# Altium schematic sheet ActuatorTop.SchDoc
size Letter
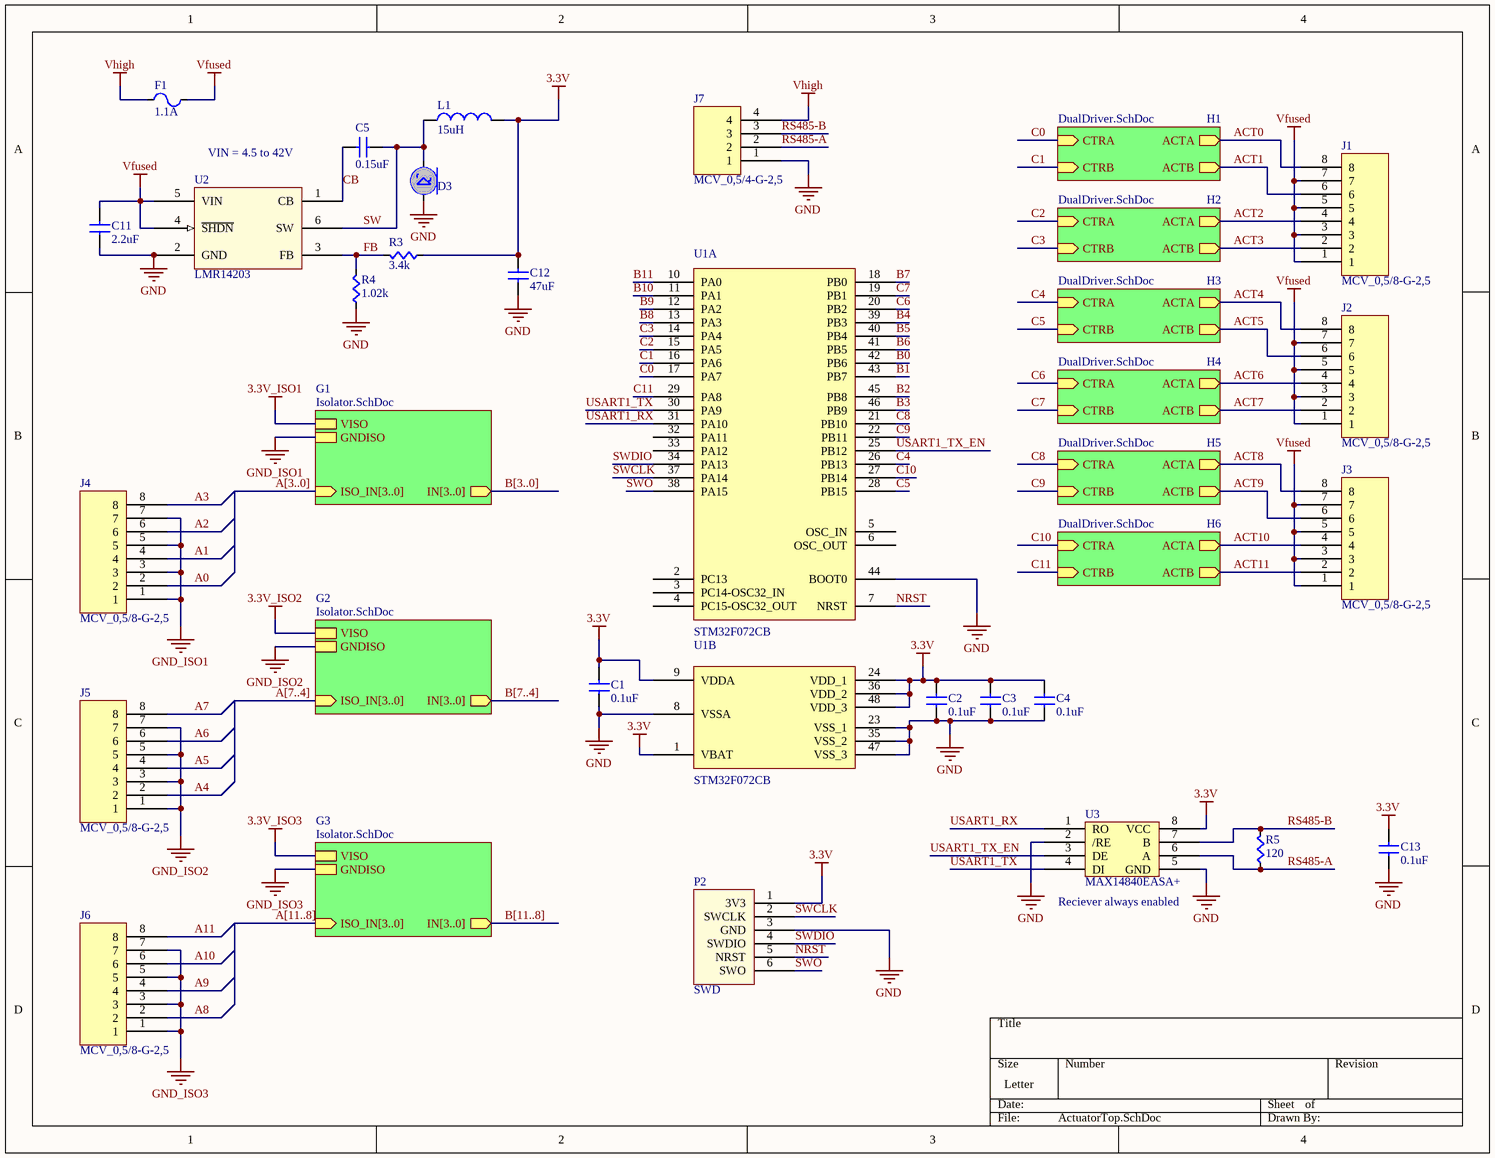
[diagram p0: ActuatorTop.SchDoc]

## Parts
C1  value 0.1uF  [CAPC0603]  (hidden comment: Cap)
C2  value 0.1uF  [CAPC0603]  (hidden comment: Cap)
C3  value 0.1uF  [CAPC0603]  (hidden comment: Cap)
C4  value 0.1uF  [CAPC0603]  (hidden comment: Cap)
C5  value 0.15uF  [CAPC0603]  (hidden comment: Cap)
C11  value 2.2uF  [CAPC0805]  (hidden comment: Cap)
C12  value 47uF  [CAPC1206]  (hidden comment: Cap)
C13  value 0.1uF  [CAPC0603]  (hidden comment: Cap)
D3  Schottky  [1N5819HW-7-F]  (value not drawn)
F1  value 1.1A  [PTC7451X11N]  (hidden comment: PTC Fuse)
J1  MCV_0,5/8-G-2,5  [MCV_0,5/8-G-2,5]
J2  MCV_0,5/8-G-2,5  [MCV_0,5/8-G-2,5]
J3  MCV_0,5/8-G-2,5  [MCV_0,5/8-G-2,5]
J4  MCV_0,5/8-G-2,5  [MCV_0,5/8-G-2,5]
J5  MCV_0,5/8-G-2,5  [MCV_0,5/8-G-2,5]
J6  MCV_0,5/8-G-2,5  [MCV_0,5/8-G-2,5]
J7  MCV_0,5/4-G-2,5  [MCV_0,5/4-G-2,5]
L1  Inductance: 15uH  [INDP6060X48N]  (hidden comment: Inductor)
P2  SWD  [SWD_STM32]
R3  value 3.4k  [RES0603]  (hidden comment: Res)
R4  value 1.02k  [RES0603]  (hidden comment: Res)
R5  value 120  [RES0603]  (hidden comment: Res)
U1  STM32F072CB  [STM32F072CB]  (parts A,B of 2)
U2  LMR14203  [SOT95P280X110-6N]
U3  MAX14840EASA+  [MAX14840EASA+]

## Sub-sheets
G1 = Isolator.SchDoc: GNDISO, VISO, ISO_IN[3..0] (in), IN[3..0] (out)
G2 = Isolator.SchDoc: GNDISO, VISO, ISO_IN[3..0] (in), IN[3..0] (out)
G3 = Isolator.SchDoc: GNDISO, VISO, ISO_IN[3..0] (in), IN[3..0] (out)
H1 = DualDriver.SchDoc: ACTA (out), CTRA (in), ACTB (out), CTRB (in)
H2 = DualDriver.SchDoc: ACTA (out), CTRA (in), ACTB (out), CTRB (in)
H3 = DualDriver.SchDoc: ACTA (out), CTRA (in), ACTB (out), CTRB (in)
H4 = DualDriver.SchDoc: ACTA (out), CTRA (in), ACTB (out), CTRB (in)
H5 = DualDriver.SchDoc: ACTA (out), CTRA (in), ACTB (out), CTRB (in)
H6 = DualDriver.SchDoc: ACTA (out), CTRA (in), ACTB (out), CTRB (in)

## Nets
3.3V: C1.1(A) C2.1(A) C3.1(A) C4.1(A) C12.2(B) C13.1(A) L1.2(B) P2.1(3V3) R3.2(B) U1.1(VBAT) U1.9(VDDA) U1.24(VDD_1) U1.36(VDD_2) U1.48(VDD_3) U3.8(VCC)
3.3V_ISO1: sheet G1/VISO
3.3V_ISO2: sheet G2/VISO
3.3V_ISO3: sheet G3/VISO
GND: C1.2(B) C2.2(B) C3.2(B) C4.2(B) C11.1(A) C12.1(A) C13.2(B) D3.A J7.1 P2.3(GND) R4.2(B) U1.8(VSSA) U1.23(VSS_1) U1.35(VSS_2) U1.44(BOOT0) U1.47(VSS_3) U2.2(GND) U3.2(/RE) U3.5(GND)
GND_ISO1: J4.1 J4.3 J4.5 J4.7 ; sheet G1/GNDISO
GND_ISO2: J5.1 J5.3 J5.5 J5.7 ; sheet G2/GNDISO
GND_ISO3: J6.1 J6.3 J6.5 J6.7 ; sheet G3/GNDISO
Vfused: C11.2(B) F1.2(B) J1.1 J1.3 J1.5 J1.7 J2.1 J2.3 J2.5 J2.7 J3.1 J3.3 J3.5 J3.7 U2.4(~{SHDN}) U2.5(VIN)
Vhigh: F1.1(A) J7.4
A0: J4.2
A1: J4.4
A2: J4.6
A3: J4.8
A4: J5.2
A5: J5.4
A6: J5.6
A7: J5.8
A8: J6.2
A9: J6.4
A10: J6.6
A11: J6.8
ACT0: J1.8 ; sheet H1/ACTA
ACT1: J1.6 ; sheet H1/ACTB
ACT2: J1.4 ; sheet H2/ACTA
ACT3: J1.2 ; sheet H2/ACTB
ACT4: J2.8 ; sheet H3/ACTA
ACT5: J2.6 ; sheet H3/ACTB
ACT6: J2.4 ; sheet H4/ACTA
ACT7: J2.2 ; sheet H4/ACTB
ACT8: J3.8 ; sheet H5/ACTA
ACT9: J3.6 ; sheet H5/ACTB
ACT10: J3.4 ; sheet H6/ACTA
ACT11: J3.2 ; sheet H6/ACTB
B0: U1.42(PB6)
B1: U1.43(PB7)
B2: U1.45(PB8)
B3: U1.46(PB9)
B4: U1.39(PB3)
B5: U1.40(PB4)
B6: U1.41(PB5)
B7: U1.18(PB0)
B8: U1.13(PA3)
B9: U1.12(PA2)
B10: U1.11(PA1)
B11: U1.10(PA0)
C0: U1.17(PA7) ; sheet H1/CTRA
C1: U1.16(PA6) ; sheet H1/CTRB
C2: U1.15(PA5) ; sheet H2/CTRA
C3: U1.14(PA4) ; sheet H2/CTRB
C4: U1.26(PB13) ; sheet H3/CTRA
C5: U1.28(PB15) ; sheet H3/CTRB
C6: U1.20(PB2) ; sheet H4/CTRA
C7: U1.19(PB1) ; sheet H4/CTRB
C8: U1.21(PB10) ; sheet H5/CTRA
C9: U1.22(PB11) ; sheet H5/CTRB
C10: U1.27(PB14) ; sheet H6/CTRA
C11: U1.29(PA8) ; sheet H6/CTRB
CB: C5.1(A) U2.1(CB)
FB: R3.1(A) R4.1(A) U2.3(FB)
NRST: P2.5(NRST) U1.7(NRST)
RS485-A: J7.2 R5.2(B) U3.6(A)
RS485-B: J7.3 R5.1(A) U3.7(B)
SW: C5.2(B) D3.C L1.1(A) U2.6(SW)
SWCLK: P2.2(SWCLK) U1.37(PA14)
SWDIO: P2.4(SWDIO) U1.34(PA13)
SWO: P2.6(SWO) U1.38(PA15)
USART1_RX: U1.31(PA10) U3.1(RO)
USART1_TX: U1.30(PA9) U3.4(DI)
USART1_TX_EN: U1.25(PB12) U3.3(DE)

Not connected (* = marked no-connect by the designer): U1 2(PC13) 3(PC14-OSC32_IN) 4(PC15-OSC32_OUT) 5(OSC_IN) 6(OSC_OUT) 32(PA11) 33(PA12)

## Buses and harness runs
bus A[3..0] = sheet G1/ISO_IN[3..0]
bus A[7..4] = sheet G2/ISO_IN[3..0]
bus A[11..8] = sheet G3/ISO_IN[3..0]
bus B[3..0] = sheet G1/IN[3..0]
bus B[7..4] = sheet G2/IN[3..0]
bus B[11..8] = sheet G3/IN[3..0]

## Notes on the sheet
- VIN = 4.5 to 42V
- (near U3) Reciever always enabled

## Library data of the parts
D3 = Schottky: Schottky Diode Template; Supplier Part Number 1: 1N5819HW-FDICT-ND; Supplier 1: Digi-Key
F1 = PTC_Fuse: Supplier 1: Digi-Key; Supplier Part Number 1: 507-1744-1-ND
J1-J6 = MCV_0,5/8-G-2,5: CONN TERM BLOCK 2.50MM 8POS, Vertical, Through-Hole, 4A; Supplier 1: Digi-Key; Supplier Part Number 1: 277-1458-ND; Mating Conn. Digi-Key P/N: 277-1436-ND
J7 = MCV_0,5/4-G-2,5: CONN TERM BLOCK 2.50MM 4POS, Vertical, Through-Hole, 4A; Supplier 1: Digi-Key; Supplier Part Number 1: 277-1454-ND; Mating Conn. Digi-Key P/N: 277-1432-ND
P2 = SWD_STM32: SWD connector matching the pinout on STM Discovery Boards; Supplier 1: Digi-Key
U1 = STM32F072CB: MCU 32BIT 128KB FLASH 48LQFP; Supplier 1: Digi-Key; Supplier Part Number 1: 497-14645-ND
U2 = LMR14203: Simple Switcher 42Vin 0.3A Step-Down Voltage Regulator; Supplier 1: Digi-Key; Supplier Part Number 1: LMR14203XMKE/NOPBCT-ND
U3 = MAX14840EASA+: TXRX 40MBPS RS485/RS422 8-SOIC; Supplier 1: Digi-Key; Supplier Part Number 1: MAX14840EASA+-ND
C1-C5 C11-C13 = Cap: Supplier 1: Digi-Key
  C1-C4 C13: Supplier Part Number 1: 445-1314-1-ND
  C5: Supplier Part Number 1: 445-13339-1-ND
  C11: Supplier Part Number 1: 445-5968-1-ND
  C12: Supplier Part Number 1: 399-5508-1-ND
L1 = Inductor: Supplier 1: Digi-Key; Supplier Part Number 1: 445-4574-1-ND
R3-R5 = Res: Supplier 1: Digi-Key
  R3: Supplier Part Number 1: 311-3.40KHRCT-ND
  R4: Supplier Part Number 1: 311-1.02KHRCT-ND
  R5: Supplier Part Number 1: 311-120HRCT-ND